# EAGLE design Rele-board (EAGLE 8.2.2)
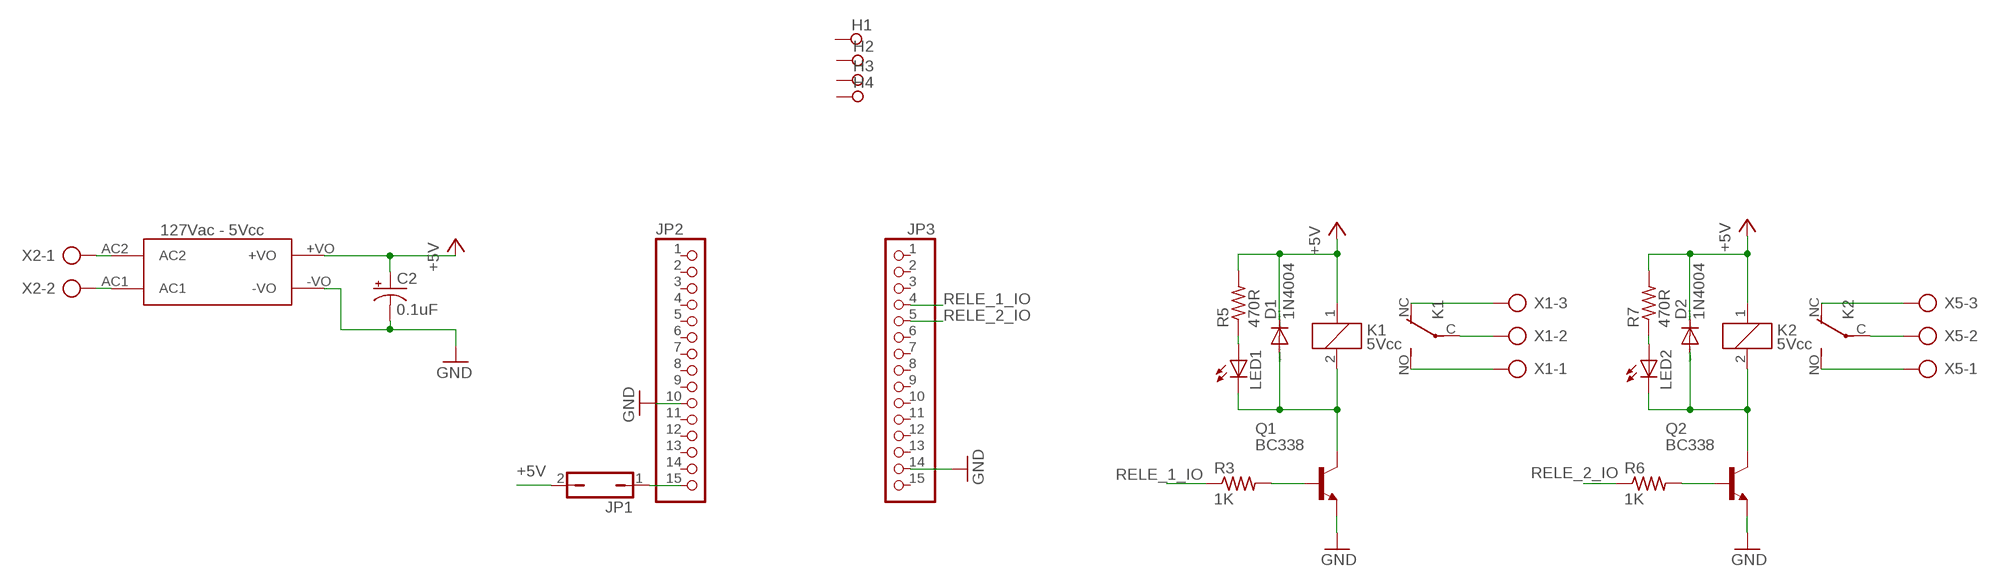
[diagram p0: schematic, sheet 1]

## Parts
C2  0.1uF  CPOL-USE2.5-6  [E2,5-6]
D1  1N4004  [DO41-10]
D2  1N4004  [DO41-10]
FONTE  HLK-PM01  [HLK-PM01]
H1  SPECIAL_DRILL_0.1000  [PAD_0.1000]
H2  SPECIAL_DRILL_0.1000  [PAD_0.1000]
H3  SPECIAL_DRILL_0.1000  [PAD_0.1000]
H4  SPECIAL_DRILL_0.1000  [PAD_0.1000]
JP1  JP1Q  [JP1]
JP2  PINHD-1X15  [1X15]
JP3  PINHD-1X15  [1X15]
K1  5Vcc  CQ1-12V  [CQ1]
K2  5Vcc  CQ1-12V  [CQ1]
LED1  LED3MM  [LED3MM]
LED2  LED3MM  [LED3MM]
Q1  BC338  [TO92-EBC]
Q2  BC338  [TO92-EBC]
R3  1K  R-US_0207/10  [0207/10]
R5  470R  R-US_0207/10  [0207/10]
R6  1K  R-US_0207/10  [0207/10]
R7  470R  R-US_0207/10  [0207/10]
X1  AK300/3  [AK300/3]
X2  AK300/2  [AK300/2]
X5  AK300/3  [AK300/3]

## Nets
+5V: C2.+ D1.C D2.C FONTE.+VO JP1.2 K1.1 K2.1 R5.2 R7.2
GND: C2.- FONTE.-VO JP2.10 JP3.14 Q1.E Q2.E
LOAD+: FONTE.AC2 X2.1
LOAD-: FONTE.AC1 X2.2
N$2: JP1.1 JP2.15
N$4: K1.C(2:P) X1.2
N$5: K1.NC(2:O) X1.3
N$6: K1.NO(2:S) X1.1
N$7: K2.C(2:P) X5.2
N$8: K2.NC(2:O) X5.3
N$9: K2.NO(2:S) X5.1
N$10: Q2.B R6.2
N$11: LED2.A R7.1
N$12: D2.A K2.2 LED2.K(C) Q2.C
N$13: Q1.B R3.2
N$14: LED1.A R5.1
N$16: D1.A K1.2 LED1.K(C) Q1.C
RELE_1_IO: JP3.4 R3.1
RELE_2_IO: JP3.5 R6.1
Unconnected: H1.1 H2.1 H3.1 H4.1 JP2.1 JP2.2 JP2.3 JP2.4 JP2.5 JP2.6 JP2.7 JP2.8 JP2.9 JP2.11 JP2.12 JP2.13 JP2.14 JP3.1 JP3.2 JP3.3 JP3.6 JP3.7 JP3.8 JP3.9 JP3.10 JP3.11 JP3.12 JP3.13 JP3.15

## Library data of the parts
C2 = rcl:CPOL-US: POLARIZED CAPACITOR, American symbol
D1 D2 = diode:1N4004: DIODE general purpose rectifier, 1 A
FONTE = hlk-pm01:HLK-PM01; FONTE: 127Vac - 5Vcc
H1-H4 = special-drill:SPECIAL_DRILL_: Special drills
JP1 = jumper:JP1Q: JUMPER
JP2 JP3 = pinhead:PINHD-1X15: PIN HEADER
K1 K2 = relay:CQ1-12V: AUTOMOTIVE QUIET RELAY NAiS Source: http://www.mew-europe.com/.. en_ds_61208_0000.pdf; OC_FARNELL: unknown; OC_NEWARK: unknown
LED1 LED2 = led:LED: LED OSRAM: - CHIPLED LG R971, LG N971, LY N971, LG Q971, LY Q971, LO R971, LY R971 LH N974, LH R974 LS Q976, LO Q976, LY Q976 LO Q996 - Hyper CHIPLED LW Q18S LB Q993, LB Q99A, LB R99A - SideLED LS A670, LO A670, LY A670, LG A670, LP A670 LB A673, LV A673, LT A673, LW A673 LH A674 LY A675 LS A676, LA A676, LO A676, LY A676, LW A676 LS A679, LY A679, LG A679 - Hyper Micro SIDELED® LS Y876, LA Y876, LO Y876, LY Y876 LT Y87S - SmartLED LW L88C, LW L88S LB L89C, LB L89S, LG L890 LS L89K, LO L89K, LY L89K LS L896, LA L896, LO L896, LY L896 - TOPLED LS T670, LO T670, LY T670, LG T670, LP T670 LSG T670, LSP T670, LSY T670, LOP T670, LYG T670 LG T671, LOG T671, LSG T671 LB T673, LV T673, LT T673, LW T673 LH T674 LS T676, LA T676, LO T676, LY T676, LB T676, LH T676, LSB T676, LW T676 LB T67C, LV T67C, LT T67C, LS T67K, LO T67K, LY T67K, LW E67C LS E67B, LA E67B, LO E67B, LY E67B, LB E67C, LV E67C, LT E67C LW T67C LS T679, LY T679, LG T679 LS T770, LO T770, LY T770, LG T770, LP T770 LB T773, LV T773, LT T773, LW T773 LH T774 LS E675, LA E675, LY E675, LS T675 LS T776, LA T776, LO T776, LY T776, LB T776 LHGB T686 LT T68C, LB T68C - Hyper Mini TOPLED® LB M676 - Mini TOPLED Santana® LG M470 LS M47K, LO M47K, LY M47K Source: http://www.osram.convergy.de LUXEON: - LUMILED® LXK2-PW12-R00, LXK2-PW12-S00, LXK2-PW14-U00, LXK2-PW14-V00 LXK2-PM12-R00, LXK2-PM12-S00, LXK2-PM14-U00 LXK2-PE12-Q00, LXK2-PE12-R00, LXK2-PE12-S00, LXK2-PE14-T00, LXK2-PE14-U00 LXK2-PB12-K00, LXK2-PB12-L00, LXK2-PB12-M00, LXK2-PB14-N00, LXK2-PB14-P00, LXK2-PB14-Q00 LXK2-PR12-L00, LXK2-PR12-M00, LXK2-PR14-Q00, LXK2-PR14-R00 LXK2-PD12-Q00, LXK2-PD12-R00, LXK2-PD12-S00 LXK2-PH12-R00, LXK2-PH12-S00 LXK2-PL12-P00, LXK2-PL12-Q00, LXK2-PL12-R00 Source: www.luxeon.com KINGBRIGHT: KA-3528ASYC Source: www.kingbright.com
Q1 Q2 = transistor-npn:BC338*: NPN Transistor
R3 R5-R7 = rcl:R-US_: RESISTOR, American symbol
X1 X5 = con-ptr500:AK300/3: CONNECTOR; OC_FARNELL: unknown; OC_NEWARK: unknown
X2 = con-ptr500:AK300/2: CONNECTOR; OC_FARNELL: unknown; OC_NEWARK: unknown

## Net classes
0 default: width 1.27 mm

## Board
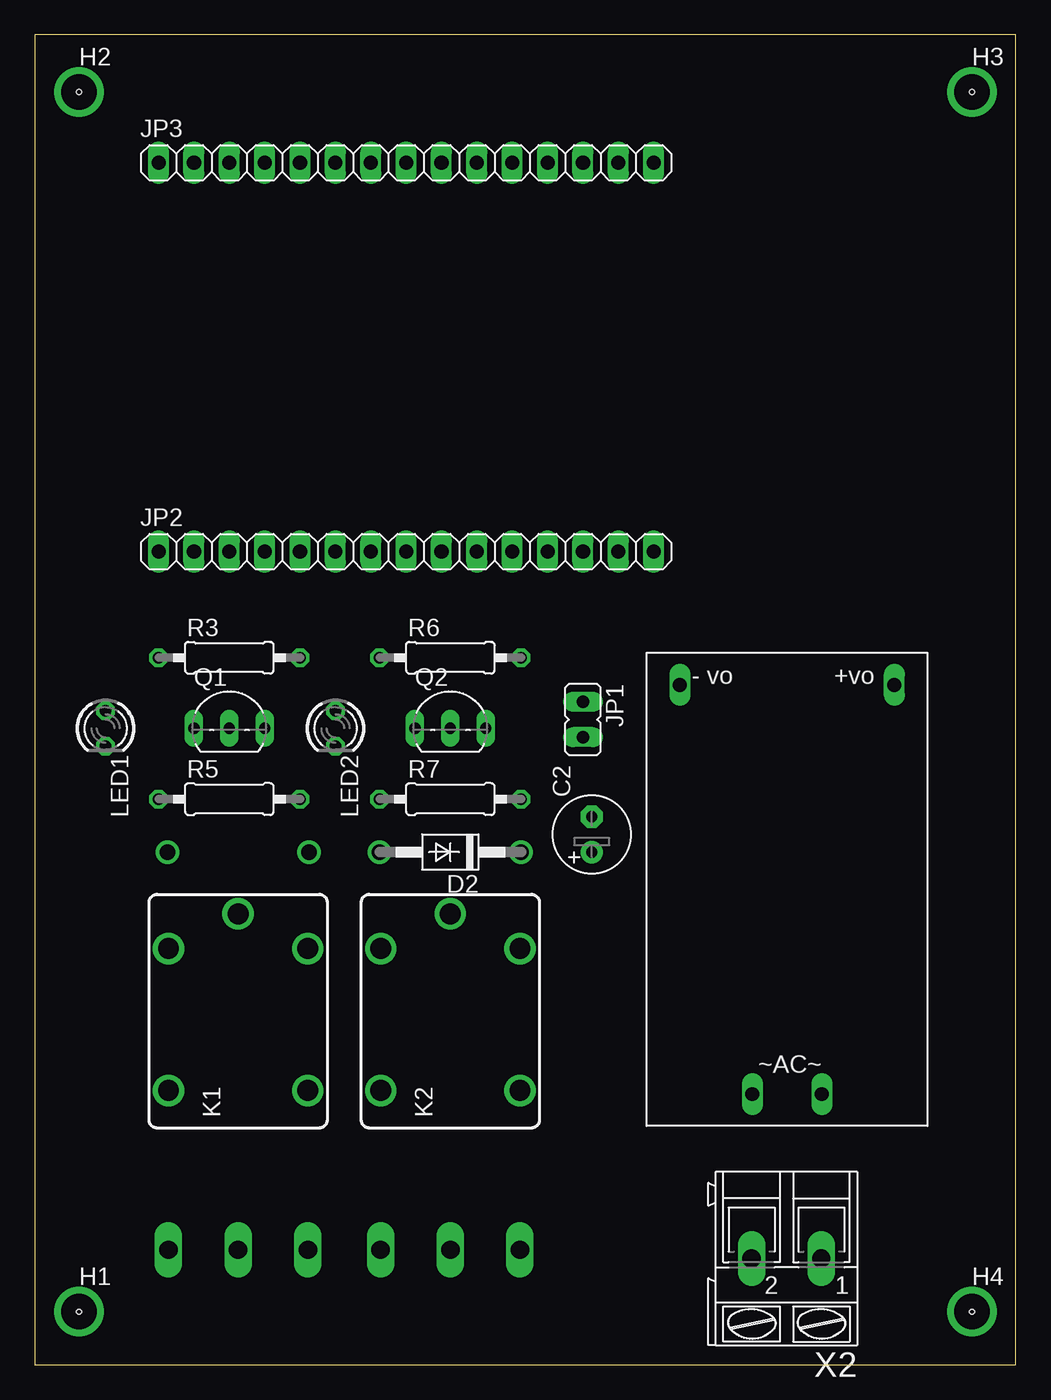
[diagram p1: board, top side]
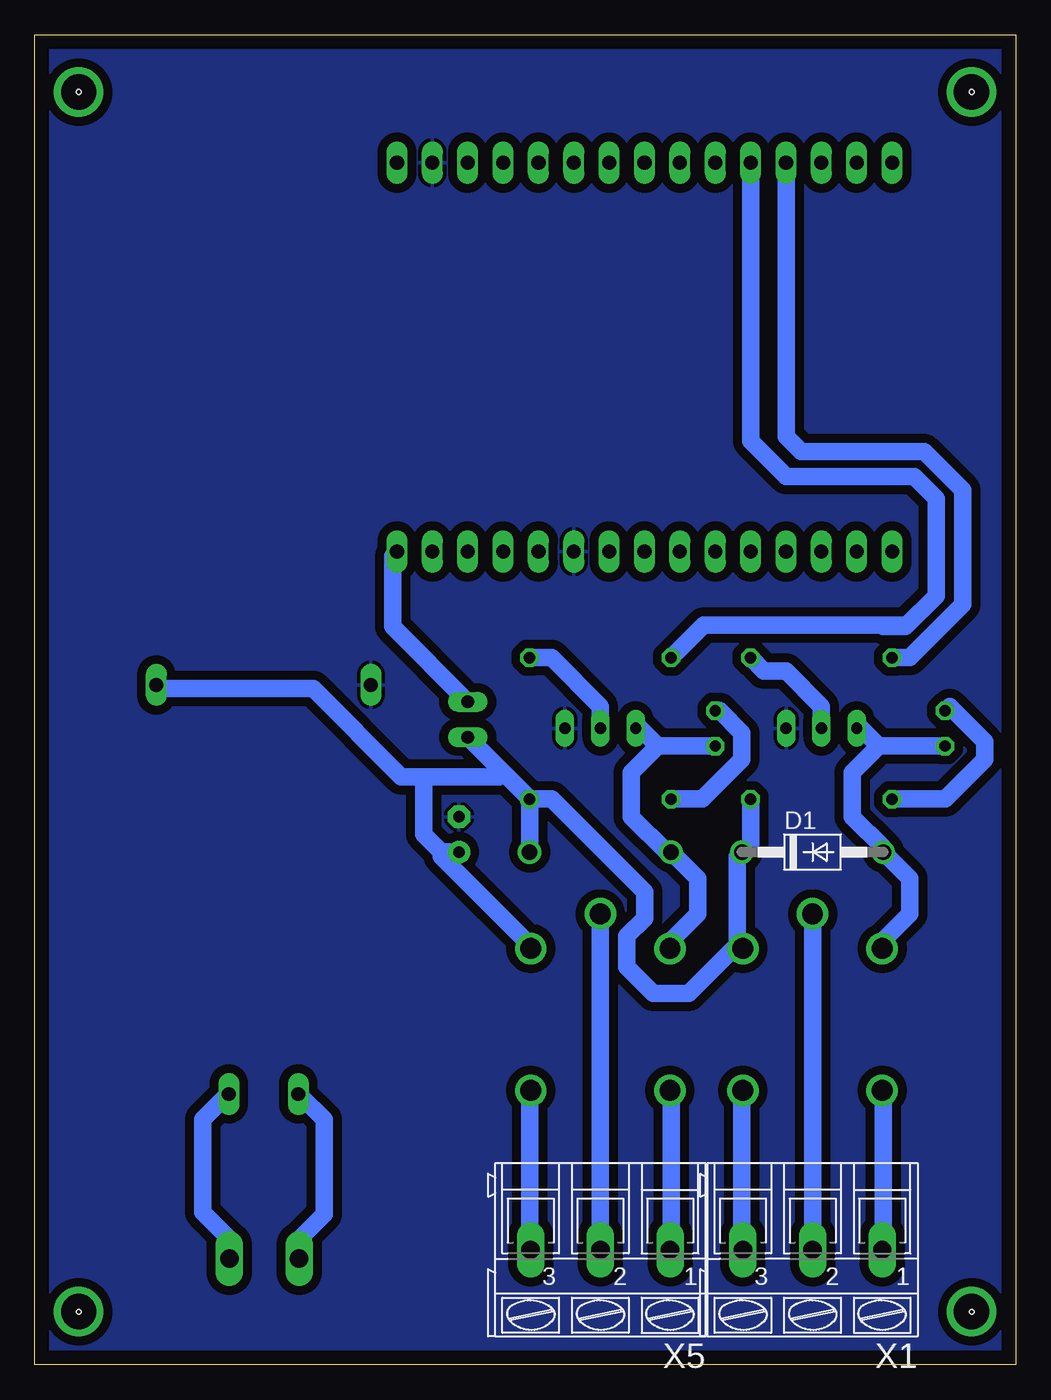
[diagram p2: board, bottom side, seen from below]

Size 70.47 x 95.55 mm. Coordinates in mm from the lower left corner, seen from the top.
Outline: 0,0 70.47,0 70.47,95.55 0,95.55 0,0
Copper layers (1*16): Top 0.035mm / dielectric 1.5mm / Bottom 0.035mm
Design rules "mycofigED *": minimum track width 10mil, minimum drill 24mil, track to track 20mil, track to pad 20mil, pad to pad 20mil, via to via 20mil, smd to smd 10mil, copper to edge 40mil, drill to drill 8mil, minimum pad ring 10mil, minimum via ring 8mil, stop-mask expansion 4mil, vias tented up to drill 0mil, thermal gap 10mil
Holes 0.35 mm at 3.18,3.81 67.31,3.81 67.31,91.44 3.18,91.44

### Footprints (pad centres in the part's own frame; a part is rotated, then mirrored left to right if it is on the bottom)
E2,5-6 = drill 0.813 pad 1.6: + -1.27,0 | drill 0.813 pad 1.6 octagon: - 1.27,0
DO41-10 = drill 1.118: A 5.08,0; C -5.08,0
HLK-PM01 = drill 1 long: +VO 31.7,2.4; -VO 31.7,17.8; AC1 2.3,12.6; AC2 2.3,7.6
PAD_0.1000 = drill 2.54 pad 2.54: 1 0,0
JP1 = drill 0.914 long: 1 0,-1.27; 2 0,1.27
1X15 = drill 1.016 long: 1 -17.78,0; 2 -15.24,0; 3 -12.7,0; 4 -10.16,0; 5 -7.62,0; 6 -5.08,0; 7 -2.54,0; 8 0,0; 9 2.54,0; 10 5.08,0; 11 7.62,0; 12 10.16,0; 13 12.7,0; 14 15.24,0; 15 17.78,0
CQ1 = drill 1.5: 1 4.5,-5; 2 4.5,5; C 7,0; NC -5.7,-5; NO -5.7,5
LED3MM = drill 0.813 octagon: A -1.27,0; K 1.27,0
TO92-EBC = drill 0.813 long: B 0,-1.27; C -2.54,-1.27; E 2.54,-1.27
0207/10 = drill 0.813 octagon: 1 -5.08,0; 2 5.08,0
AK300/3 = drill 1.321 long: 1 -5.004,0; 2 0,0; 3 5.004,0
AK300/2 = drill 1.321 long: 1 -2.515,0; 2 2.489,0

### Placement (x,y rotation side)
C2  40.01,38.1 90 top
D1  14.61,36.83 0 bottom
D2  29.84,36.83 180 top
FONTE  64.13,17.14 90 top
H1  3.18,3.81 0 top
H2  3.18,91.44 0 top
H3  67.31,91.44 0 top
H4  67.31,3.81 0 top
JP1  39.37,46.35 180 top
JP2  26.67,58.42 0 top
JP3  26.67,86.36 0 top
K1  14.61,25.4 90 top
K2  29.84,25.4 90 top
LED1  5.08,45.72 270 top
LED2  21.59,45.72 270 top
Q1  13.97,46.99 0 top
Q2  29.84,46.99 0 top
R3  13.97,50.8 0 top
R5  13.97,40.64 0 top
R6  29.84,50.8 0 top
R7  29.84,40.64 0 top
X1  14.61,8.25 180 bottom
X2  53.98,7.62 180 top
X5  29.84,8.25 180 bottom

### Tracks (layer width: path | path; a pad name or v marks a point on that pad's centre or on a via)
+5V
  Bottom 1.27: R5.2 19.05,37.46 D1.C 20,36.51 20,30.16 19.68,29.85 K1.1 20.32,29.85 23.49,26.67 26.04,26.67 27.94,28.57 27.94,30.8 26.67,32.07 26.67,33.97 33.34,40.64 R7.2 | JP1.2 36.83,42.54 | 36.83,42.54 R7.2 | 42.55,42.23 37.15,42.23 36.83,42.54 | 42.55,42.23 44.13,42.23 50.48,48.58 61.6,48.58 FONTE.+VO | 41.27,36.83 C2.+ | 41.27,36.83 42.55,38.1 42.55,42.23 | R7.2 D2.C | K2.1 34.92,30.16 41.27,36.51 41.27,36.83
GND
  pour Bottom (isolate 0.635): 0,95.25 70.49,95.25 70.49,0.64 0,0
LOAD+
  Bottom 1.27: FONTE.AC2 56.67,19.37 58.42,17.62 58.42,10.95 56.36,8.89 X2.1
LOAD-
  Bottom 1.27: FONTE.AC1 51.44,19.37 49.69,17.62 49.69,10.79 51.59,8.89 X2.2
N$2
  Bottom 1.27: JP1.1 44.77,53.02 44.77,58.1 JP2.15
N$4
  Bottom 1.27: K1.C X1.2
N$5
  Bottom 1.27: X1.3 19.68,8.25 19.68,19.69 K1.NC
N$6
  Bottom 1.27: X1.1 9.52,8.25 9.52,19.69 K1.NO
N$7
  Bottom 1.27: K2.C X5.2
N$8
  Bottom 1.27: X5.3 34.92,8.25 34.92,19.69 K2.NC
N$9
  Bottom 1.27: X5.1 24.77,8.25 24.77,19.69 K2.NO
N$10
  Bottom 1.27: Q2.B 29.84,47.31 33.34,50.8 R6.2
N$11
  Bottom 1.27: R7.1 22.54,40.64 19.68,43.5 19.68,45.4 21.27,46.99 LED2.A
N$12
  Bottom 1.27: 25.72,44.45 LED2.K | 25.72,44.45 26.99,45.72 Q2.C | K2.2 25.08,30.16 22.86,32.38 22.86,34.92 D2.A 25.08,36.83 27.62,39.37 27.62,42.54 25.72,44.45
N$13
  Bottom 1.27: Q1.B 13.97,47.31 16.51,49.85 18.1,49.85 R3.2
N$14
  Bottom 1.27: R5.1 5.08,40.64 2.22,43.5 2.22,44.77 4.76,47.31 LED1.A
N$16
  Bottom 1.27: 9.84,44.45 LED1.K | 9.84,44.45 11.11,45.72 Q1.C | K1.2 9.84,30.16 7.62,32.38 7.62,34.92 D1.A 9.52,37.15 11.75,39.37 11.75,42.54 9.84,44.45
RELE_1_IO
  Bottom 1.27: R3.1 7.62,50.8 3.81,54.61 3.81,62.84 6.57,65.6 15.43,65.6 16.51,66.67 JP3.4
RELE_2_IO
  Bottom 1.27: 7.94,53.02 9.52,53.02 | 7.94,53.02 5.71,55.24 5.71,62.23 7.3,63.82 16.51,63.82 19.05,66.36 JP3.5 | 7.94,53.02 8.05,53.14 22.43,53.14 R6.1